# Altium schematic sheet RF_Transceiver_LMS6003D_TopLevel.SchDoc
size A4; DocumentNumber: 44; SheetNumber: 44; SheetTotal: 47
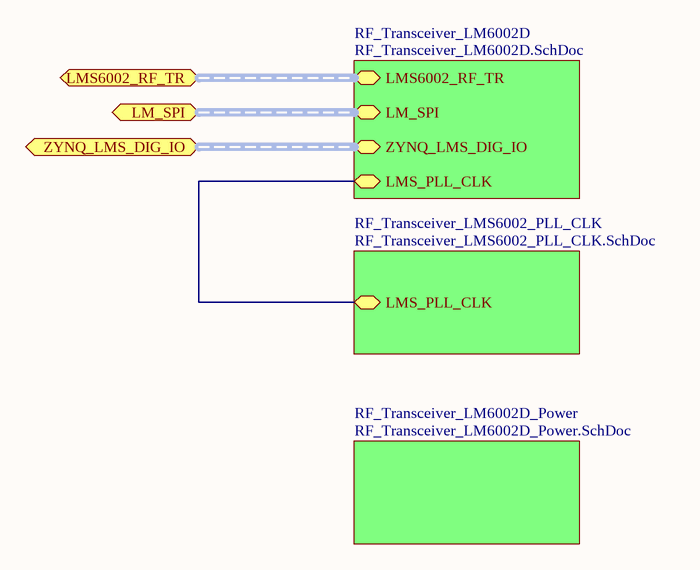
[diagram p0: RF_Transceiver_LMS6003D_TopLevel.SchDoc]

## Sub-sheets
RF_Transceiver_LM6002D = RF_Transceiver_LM6002D.SchDoc: LMS6002_RF_TR (harness LMS6002_RF_TR), LM_SPI (harness LM_SPI), ZYNQ_LMS_DIG_IO (harness DIG_IO), LMS_PLL_CLK (bidir)
RF_Transceiver_LM6002D_Power = RF_Transceiver_LM6002D_Power.SchDoc: no entries
RF_Transceiver_LMS6002_PLL_CLK = RF_Transceiver_LMS6002_PLL_CLK.SchDoc: LMS_PLL_CLK (bidir)

## Ports
LM_SPI (harness LM_SPI), LMS6002_RF_TR (harness LMS6002_RF_TR), ZYNQ_LMS_DIG_IO (harness DIG_IO)

## Nets
(unnamed): sheet RF_Transceiver_LM6002D/LMS_PLL_CLK, sheet RF_Transceiver_LMS6002_PLL_CLK/LMS_PLL_CLK

## Buses and harness runs
harness port LM_SPI = sheet RF_Transceiver_LM6002D/LM_SPI
harness port LMS6002_RF_TR = sheet RF_Transceiver_LM6002D/LMS6002_RF_TR
harness port ZYNQ_LMS_DIG_IO = sheet RF_Transceiver_LM6002D/ZYNQ_LMS_DIG_IO